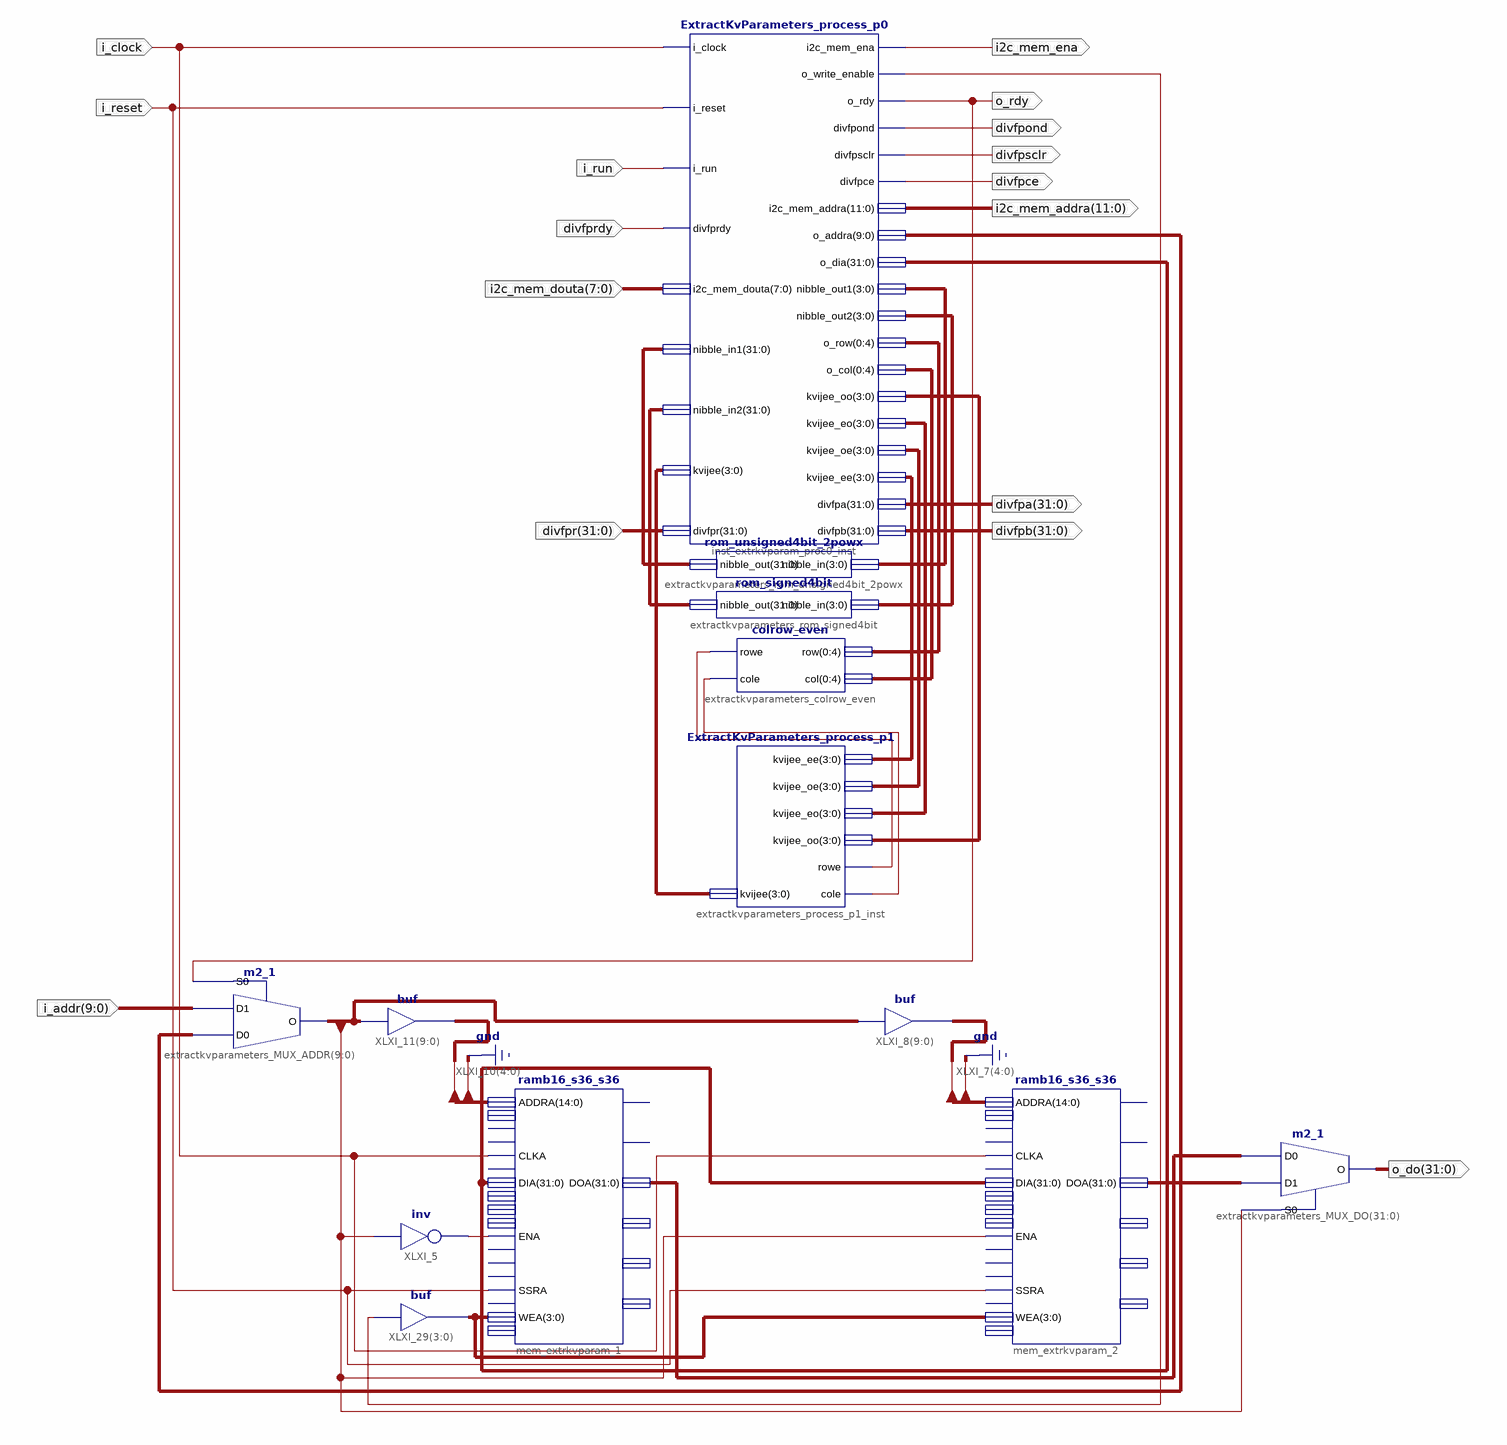
[diagram p0: schematic sheet 1]
// Xilinx ISE schematic ExtractKvParameters.sch (virtex4) as structural Verilog: 13 symbols, 16 ports
module ExtractKvParameters (
  input  [9:0] i_addr,
  input  i_reset,
  input  i_clock,
  input  i_run,
  input  divfprdy,
  input  [7:0] i2c_mem_douta,
  input  [31:0] divfpr,
  output [31:0] o_do,
  output o_rdy,
  output i2c_mem_ena,
  output divfpond,
  output divfpsclr,
  output divfpce,
  output [11:0] i2c_mem_addra,
  output [31:0] divfpa,
  output [31:0] divfpb
);

  wire XLXN_59, XLXN_186, XLXN_187, XLXN_216;
  wire [3:0] XLXN_139, XLXN_194, XLXN_195, XLXN_202, XLXN_203, XLXN_204, XLXN_205, XLXN_209;
  wire [4:0] XLXN_188, XLXN_189;
  wire [9:0] mux_addr1, XLXN_210;
  wire [14:5] XLXN_44, XLXN_45;
  wire [31:0] XLXN_78, XLXN_79, XLXN_200, XLXN_201, XLXN_211;

  assign XLXN_45 = mux_addr1;  // buf XLXI_8[9..0], 10 bits wide
  assign XLXN_44 = mux_addr1;  // buf XLXI_11[9..0], 10 bits wide
  not XLXI_5 (XLXN_59, mux_addr1[9]);
  ramb16_s36_s36 #(.WRITE_WIDTH_B(36), .WRITE_WIDTH_A(36), .WRITE_MODE_B("READ_FIRST"), .WRITE_MODE_A("READ_FIRST"), .READ_WIDTH_B(36), .READ_WIDTH_A(36)) mem_extrkvparam_1 (
    .ADDRA({XLXN_44, {5{1'b0}}}), .CLKA(i_clock), .DIA(XLXN_211), .ENA(XLXN_59), .SSRA(i_reset),
    .WEA(XLXN_139), .DOA(XLXN_79));  // open: ADDRB, CASCADEINA, CASCADEINB, CLKB, DIB, DIPA, DIPB, REGCEA, REGCEB, ENB, SSRB, WEB, CASCADEOUTA, CASCADEOUTB, DOB, DOPA, DOPB
  m2_1 extractkvparameters_MUX_DO[31:0] (.D0(XLXN_79), .D1(XLXN_78), .S0(mux_addr1[9]), .O(o_do));
  assign XLXN_139 = {4{XLXN_216}};  // buf XLXI_29[3..0], 4 bits wide
  m2_1 extractkvparameters_MUX_ADDR[9:0] (.D0(XLXN_210), .D1(i_addr), .S0(o_rdy), .O(mux_addr1));
  ramb16_s36_s36 #(.WRITE_WIDTH_B(36), .WRITE_WIDTH_A(36), .WRITE_MODE_B("READ_FIRST"), .WRITE_MODE_A("READ_FIRST"), .READ_WIDTH_B(36), .READ_WIDTH_A(36)) mem_extrkvparam_2 (
    .ADDRA({XLXN_45, {5{1'b0}}}), .CLKA(i_clock), .DIA(XLXN_211), .ENA(mux_addr1[9]), .SSRA(i_reset),
    .WEA(XLXN_139), .DOA(XLXN_78));  // open: ADDRB, CASCADEINA, CASCADEINB, CLKB, DIB, DIPA, DIPB, REGCEA, REGCEB, ENB, SSRB, WEB, CASCADEOUTA, CASCADEOUTB, DOB, DOPA, DOPB
  ExtractKvParameters_process_p0 inst_extrkvparam_proc0_inst (
    .i_clock(i_clock), .i_reset(i_reset), .i_run(i_run), .divfprdy(divfprdy), .i2c_mem_douta(i2c_mem_douta),
    .nibble_in1(XLXN_200), .nibble_in2(XLXN_201), .kvijee(XLXN_209), .divfpr(divfpr),
    .i2c_mem_ena(i2c_mem_ena), .o_write_enable(XLXN_216), .o_rdy(o_rdy), .divfpond(divfpond),
    .divfpsclr(divfpsclr), .divfpce(divfpce), .i2c_mem_addra(i2c_mem_addra), .o_addra(XLXN_210),
    .o_dia(XLXN_211), .nibble_out1(XLXN_194), .nibble_out2(XLXN_195),
    .o_row({XLXN_188[0], XLXN_188[1], XLXN_188[2], XLXN_188[3], XLXN_188[4]}),
    .o_col({XLXN_189[0], XLXN_189[1], XLXN_189[2], XLXN_189[3], XLXN_189[4]}), .kvijee_oo(XLXN_205),
    .kvijee_eo(XLXN_204), .kvijee_oe(XLXN_203), .kvijee_ee(XLXN_202), .divfpa(divfpa), .divfpb(divfpb));
  rom_unsigned4bit_2powx extractkvparameters_rom_unsigned4bit_2powx (.nibble_in(XLXN_194), .nibble_out(XLXN_200));
  rom_signed4bit extractkvparameters_rom_signed4bit (.nibble_in(XLXN_195), .nibble_out(XLXN_201));
  colrow_even extractkvparameters_colrow_even (
    .col({XLXN_189[0], XLXN_189[1], XLXN_189[2], XLXN_189[3], XLXN_189[4]}),
    .row({XLXN_188[0], XLXN_188[1], XLXN_188[2], XLXN_188[3], XLXN_188[4]}), .cole(XLXN_187), .rowe(XLXN_186));
  ExtractKvParameters_process_p1 extractkvparameters_process_p1_inst (
    .cole(XLXN_187), .rowe(XLXN_186), .kvijee_oo(XLXN_205), .kvijee_eo(XLXN_204), .kvijee_oe(XLXN_203),
    .kvijee_ee(XLXN_202), .kvijee(XLXN_209));
endmodule
